# EasyEDA schematic SCH_birdo_2021-11-24.json

## Sheets
1 base: TITLE: base; REV: 1.0; Date: 2021-11-21; Sheet: 1/1; Drawn By: Luke van Luijn; Company: Bout Electronics
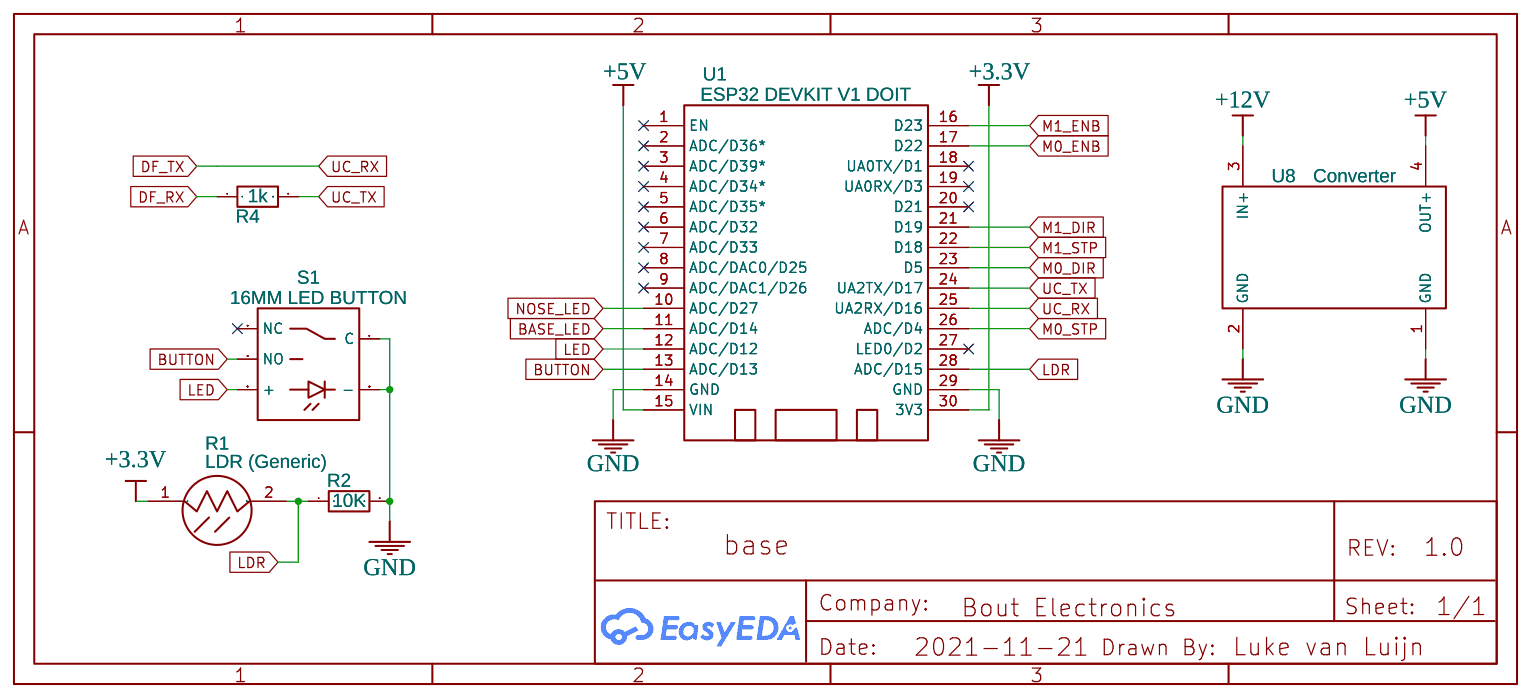
[diagram p0: base]
2 sound: TITLE: sound; Date: 2021-11-24; Company: Bout electronics
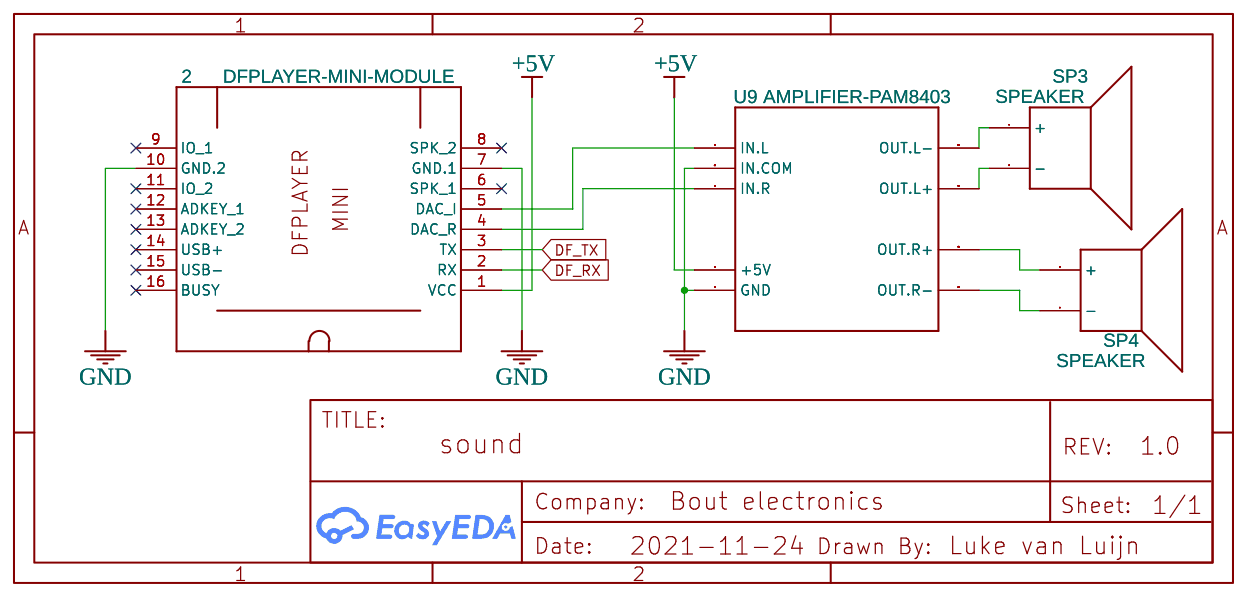
[diagram p1: sound]
3 motors: TITLE: stepper motors; Date: 2021-11-24; Company: Bout electronics
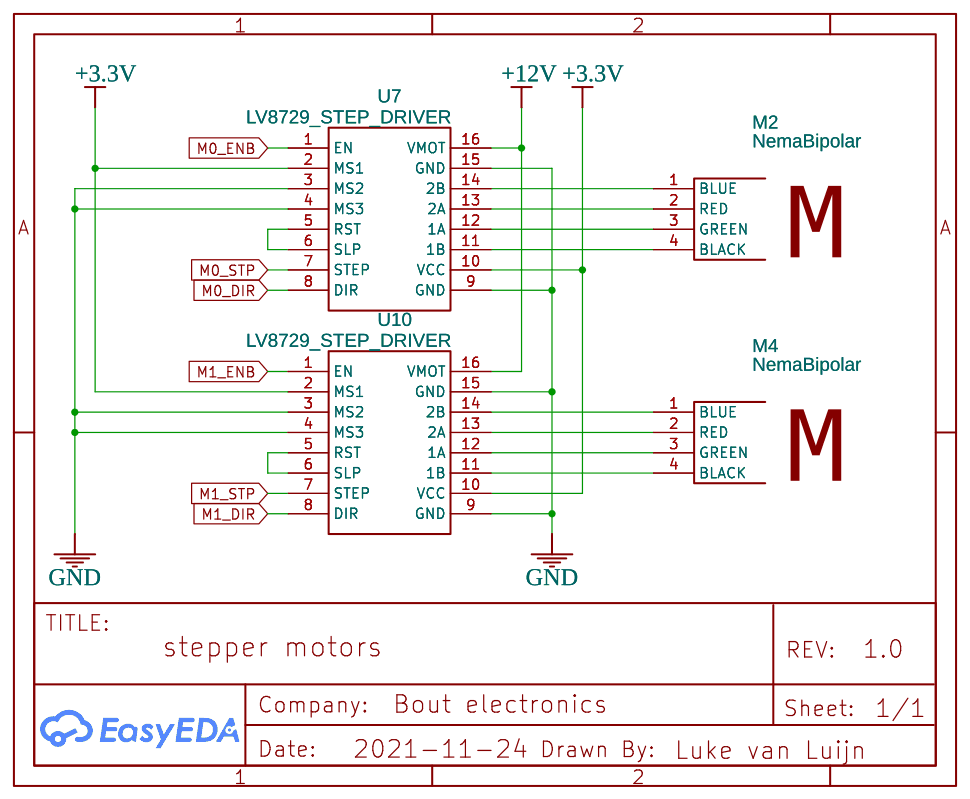
[diagram p2: motors]
4 LEDs: TITLE: LEDs; Date: 2021-11-24; Company: Bout electronics
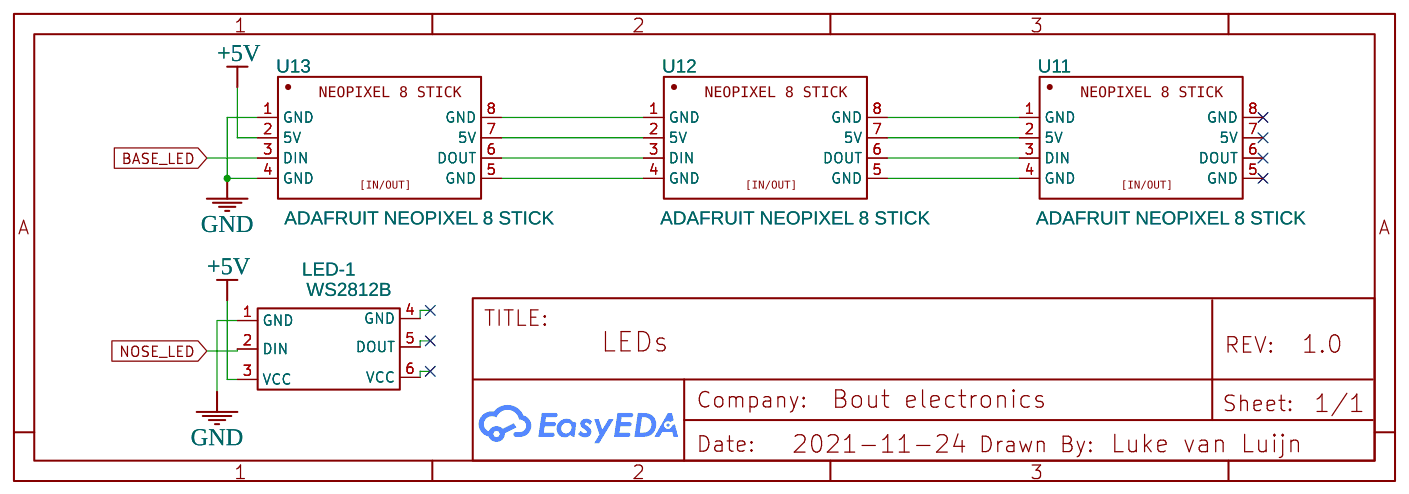
[diagram p3: LEDs]

## Parts
sheet base
R1  LDR (Generic)  [LDR]
R2  10K  [R_AXIAL-0.3]
R4  1k  [R_AXIAL-0.3]
S1  16MM LED BUTTON  [16MM LED 12V MOMENTARY PUSH BUTTON]
U1  ESP32 DEVKIT V1 DOIT  [DOIT-ESP32-DEVKIT-V1]
U8  Converter  [STEPDOWNCONVERTER]
sheet LEDs
LED-1  WS2812B  [WS2812B - LED STRIP - 1X]
U11  ADAFRUIT NEOPIXEL 8 STICK  [ADAFRUIT NEOPIXEL 8 STICK [IN/OUT]]
U12  ADAFRUIT NEOPIXEL 8 STICK  [ADAFRUIT NEOPIXEL 8 STICK [IN/OUT]]
U13  ADAFRUIT NEOPIXEL 8 STICK  [ADAFRUIT NEOPIXEL 8 STICK [IN/OUT]]
sheet motors
M2  NemaBipolar
M4  NemaBipolar
U7  LV8729_STEP_DRIVER  [LV8729_STEP_DRIVER]
U10  LV8729_STEP_DRIVER  [LV8729_STEP_DRIVER]
sheet sound
2  DFPLAYER-MINI-MODULE  [DFPLAYER-MINI-MODULE]
SP3  SPEAKER  [SPEAKER]
SP4  SPEAKER  [SPEAKER]
U9  AMPLIFIER-PAM8403  [AMPLIFIER-PAM8403]

## Library data of the parts
R1 = LDR (Generic): Contributor: krmoyle76
R2 R4 = R_AXIAL-0.3_EU: Contributor: LCEDA_Lib
S1 = 16MM LED 12V MOMENTARY PUSH BUTTON: Manufacturer Part: LED BTN; Supplier Part: 16mm Momentary Push Button 12V; link: aliexpress.ru/item/32697109472.html; Contributor: Tim Constantinov
U1 = ESP32 DEVKIT V1 DOIT: Contributor: ConceitoTeam
U8 = StepDownConverter: Contributor: alwashe
LED-1 = WS2812B: Contributor: Iskander Vafin
U11-U13 = ADAFRUIT NEOPIXEL 8 STICK [IN/OUT]: Manufacturer Part: 1426; Supplier Part: 1528-1354-ND; Supplier: Adafruit; link: https://www.adafruit.com/product/2868; Contributor: 11captainkirk
M2 M4 = NemaBipolar: Contributor: zmanpac
U7 U10 = LV8729_STEP_DRIVER: Manufacturer Part: A4988 MODULE; Contributor: Young Ohn Kang
2 = DFPLAYER-MINI-MODULE: Contributor: moung
SP3 SP4 = SPEAKER: Contributor: capnbio
U9 = AMPLIFIER-PAM8403: Stereo Class-D 3W Audio Amplifier based on PAM8403 chip

## Nets
+3.3V: R1.1 U1.30(3V3) U7.2(MS1) U7.10(VCC) U10.2(MS1) U10.10(VCC)
+5V: 2.1(VCC) LED-1.3(VCC) U1.15(VIN) U8.4(OUT+) U9.+5V U13.2(5V)
+12V: U7.16(VMOT) U8.3(IN+) U10.16(VMOT)
GND: 2.7(GND.1) 2.10(GND.2) LED-1.1(GND) R2.2 S1.C S1.GND(-) U1.14(GND) U1.29(GND) U7.3(MS2) U7.4(MS3) U7.9(GND) U7.15(GND) U8.1(GND) U8.2(GND) U9.GND U9.IN.COM U10.3(MS2) U10.4(MS3) U10.9(GND) U10.15(GND) U13.1(GND) U13.4(GND)
BASE_LED: U1.11(ADC/D14) U13.3(DIN)
BUTTON: S1.NO U1.13(ADC/D13)
DF_RX: 2.2(RX) R4.1
DF_TX: 2.3(TX) U1.25(UA2RX/D16)
LDR: R1.2 R2.1 U1.28(ADC/D15)
LED: S1.VCC(+) U1.12(ADC/D12)
M0_DIR: U1.23(D5) U7.8(DIR)
M0_ENB: U1.17(D22) U7.1(EN)
M0_STP: U1.26(ADC/D4) U7.7(STEP)
M1_DIR: U1.21(D19) U10.8(DIR)
M1_ENB: U1.16(D23) U10.1(EN)
M1_STP: U1.22(D18) U10.7(STEP)
NOSE_LED: LED-1.2(DIN) U1.10(ADC/D27)
UC_TX: R4.2 U1.24(UA2TX/D17)
Net-(2-4): 2.4(DAC_R) U9.IN.R
Net-(2-5): 2.5(DAC_I) U9.IN.L
Net-(M2-1): M2.1(BLUE) U7.14(2B)
Net-(M2-2): M2.2(RED) U7.13(2A)
Net-(M2-3): M2.3(GREEN) U7.12(1A)
Net-(M2-4): M2.4(BLACK) U7.11(1B)
Net-(M4-1): M4.1(BLUE) U10.14(2B)
Net-(M4-2): M4.2(RED) U10.13(2A)
Net-(M4-3): M4.3(GREEN) U10.12(1A)
Net-(M4-4): M4.4(BLACK) U10.11(1B)
Net-(SP3-1): SP3.1(+) U9.OUT.L-
Net-(SP3-2): SP3.2(-) U9.OUT.L+
Net-(SP4-1): SP4.1(+) U9.OUT.R+
Net-(SP4-2): SP4.2(-) U9.OUT.R-
Net-(U7-5): U7.5(RST) U7.6(SLP)
Net-(U10-5): U10.5(RST) U10.6(SLP)
Net-(U11-1): U11.1(GND) U12.8(GND)
Net-(U11-2): U11.2(5V) U12.7(5V)
Net-(U11-3): U11.3(DIN) U12.6(DOUT)
Net-(U11-4): U11.4(GND) U12.5(GND)
Net-(U12-1): U12.1(GND) U13.8(GND)
Net-(U12-2): U12.2(5V) U13.7(5V)
Net-(U12-3): U12.3(DIN) U13.6(DOUT)
Net-(U12-4): U12.4(GND) U13.5(GND)

Not connected (* = marked no-connect by the designer): 2 6(SPK_1)* 8(SPK_2)* 9(IO_1)* 11(IO_2)* 12(ADKEY_1)* 13(ADKEY_2)* 14(USB+)* 15(USB-)* 16(BUSY)*; LED-1 4(GND) 5(DOUT) 6(VCC); S1 NC*; U1 1(EN)* 2(ADC/D36*)* 3(ADC/D39*)* 4(ADC/D34*)* 5(ADC/D35*)* 6(ADC/D32)* 7(ADC/D33)* 8(ADC/DAC0/D25)* 9(ADC/DAC1/D26)* 18(UA0TX/D1)* 19(UA0RX/D3)* 20(D21)* 27(LED0/D2)*; U11 5(GND)* 6(DOUT)* 7(5V)* 8(GND)*
